# Altium schematic sheet Sensorunit.SchDoc
size 508 x 381 mm; SheetNumber: 1; SheetTotal: 1
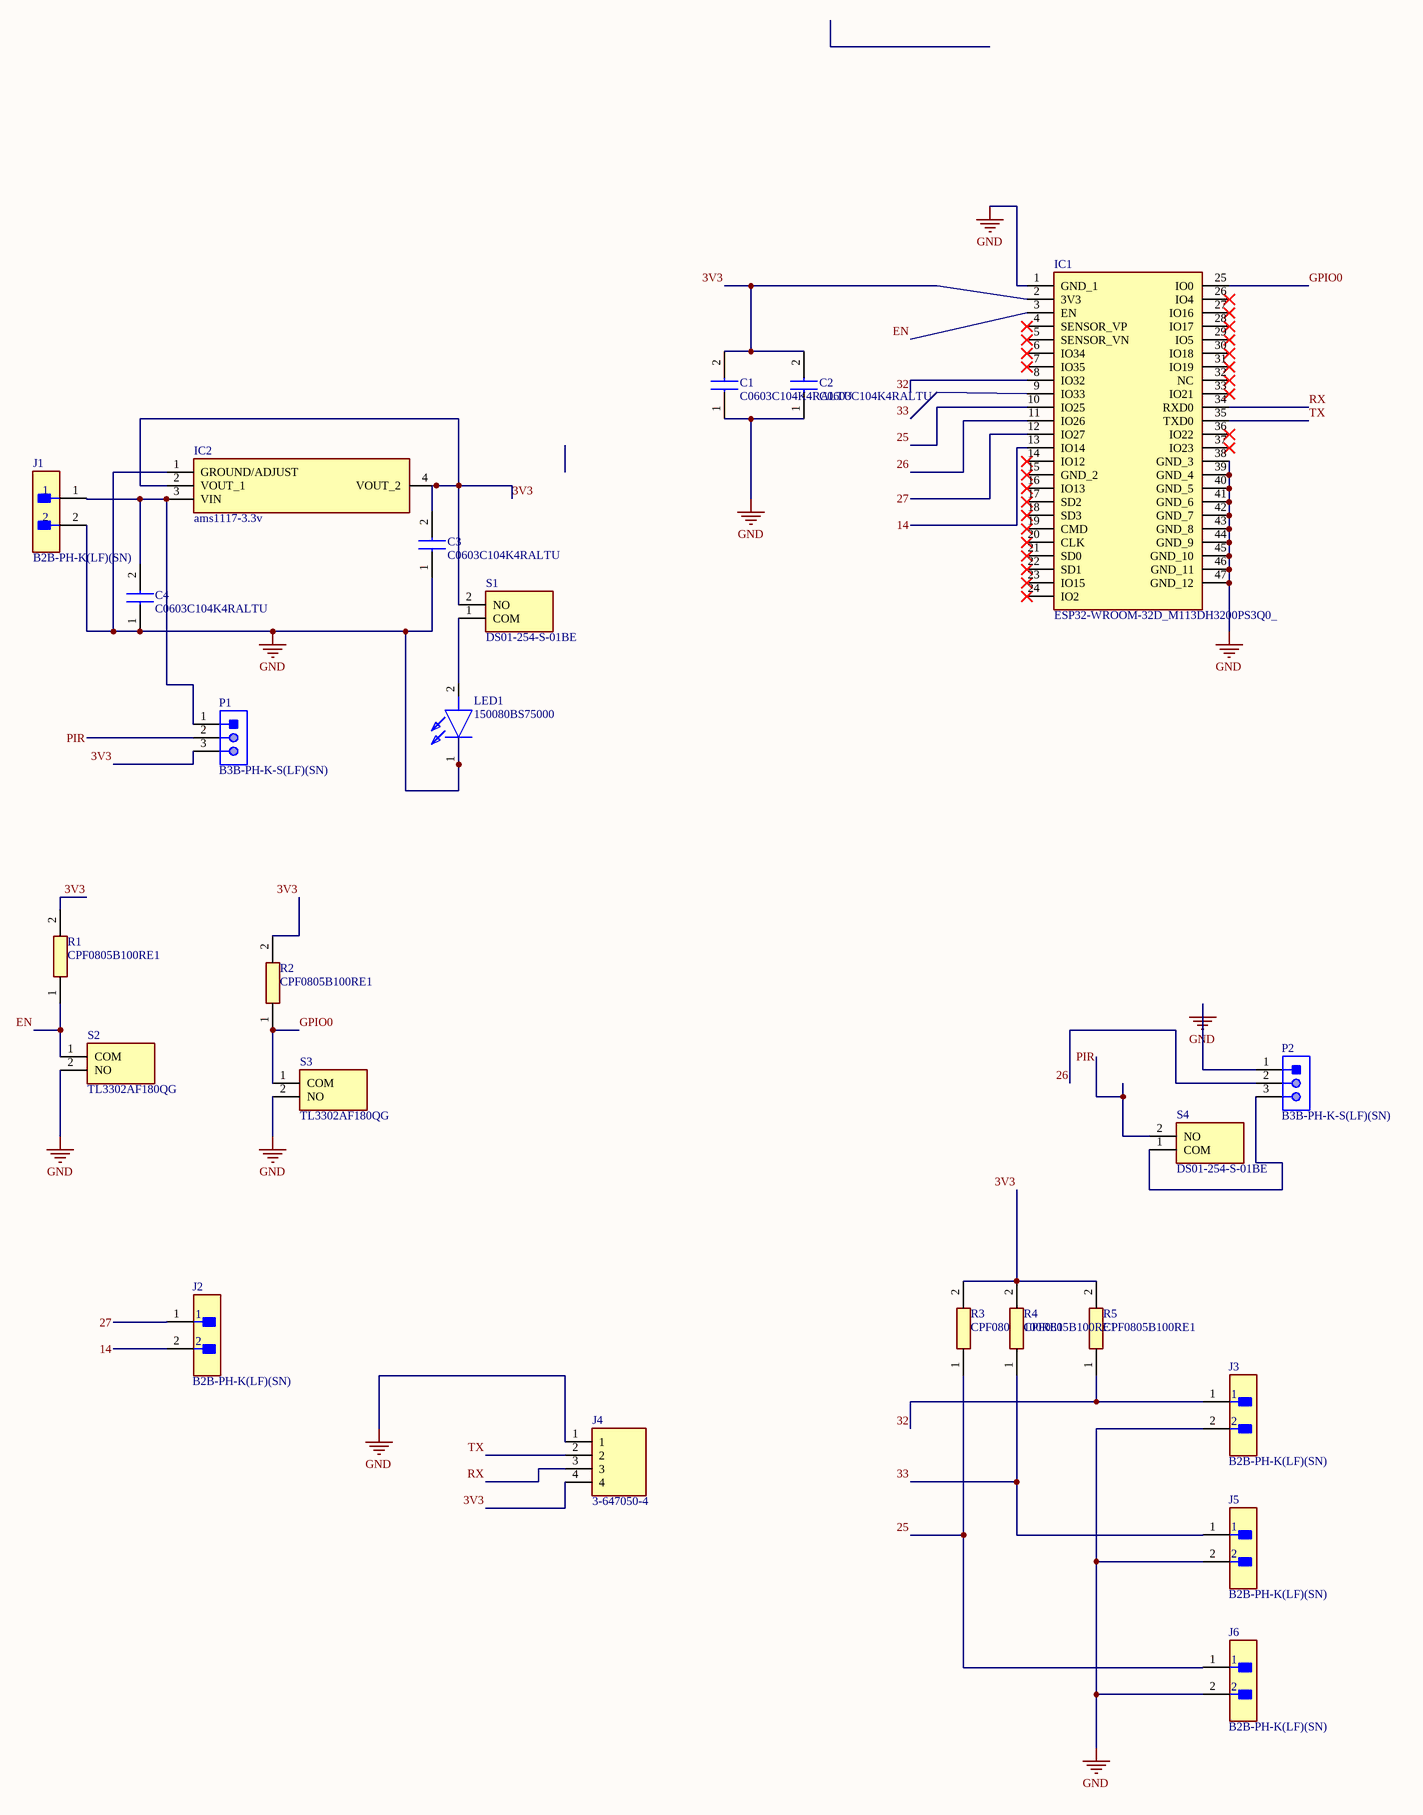
[diagram p0: Sensorunit.SchDoc]

## Parts
C1  C0603C104K4RALTU  [C0603]
C2  C0603C104K4RALTU  [C0603]
C3  C0603C104K4RALTU  [C0603]
C4  C0603C104K4RALTU  [C0603]
IC1  ESP32-WROOM-32D_M113DH3200PS3Q0_  [ESP32WROOM32DM113DH3200PS3Q0]
IC2  ams1117-3.3v  [SOT229P700X180-4N]
J1  B2B-PH-K(LF)(SN)  [FP-B2B-PH-K_LF_SN-MFG]
J2  B2B-PH-K(LF)(SN)  [FP-B2B-PH-K_LF_SN-MFG]
J3  B2B-PH-K(LF)(SN)  [FP-B2B-PH-K_LF_SN-MFG]
J4  3-647050-4  [SHDR4W66P0X254_1X4_1016X635X1079P]
J5  B2B-PH-K(LF)(SN)  [FP-B2B-PH-K_LF_SN-MFG]
J6  B2B-PH-K(LF)(SN)  [FP-B2B-PH-K_LF_SN-MFG]
LED1  150080BS75000  [LEDC2012X80N]
P1  B3B-PH-K-S(LF)(SN)  [JST-B3B-PH-K-S-3_V]
P2  B3B-PH-K-S(LF)(SN)  [JST-B3B-PH-K-S-3_V]
R1  CPF0805B100RE1  [RESC2012X65N]
R2  CPF0805B100RE1  [RESC2012X65N]
R3  CPF0805B100RE1  [RESC2012X65N]
R4  CPF0805B100RE1  [RESC2012X65N]
R5  CPF0805B100RE1  [RESC2012X65N]
S1  DS01-254-S-01BE  [DS01254S01BE]
S2  TL3302AF180QG  [TL3302AF180QG]
S3  TL3302AF180QG  [TL3302AF180QG]
S4  DS01-254-S-01BE  [DS01254S01BE]

## Nets
GND: C1.1 C2.1 C3.1 C4.1 IC1.1(GND_1) IC1.38(GND_3) IC1.39(GND_4) IC1.40(GND_5) IC1.41(GND_6) IC1.42(GND_7) IC1.43(GND_8) IC1.44(GND_9) IC1.45(GND_10) IC1.46(GND_11) IC1.47(GND_12) IC2.1(GROUND/ADJUST) J1.2 J3.2 J4.1 J5.2 J6.2 LED1.1(K) P2.1 S2.2(NO) S3.2(NO)
3V3: C1.2 C2.2 C3.2 IC1.2(3V3) IC2.2(VOUT_1) IC2.4(VOUT_2) J4.4 P1.3 R1.2 R2.2 R3.2 R4.2 R5.2 S1.2(NO)
14: IC1.13(IO14) J2.2
25: IC1.10(IO25) J6.1 R3.1
26: IC1.11(IO26) P2.2
27: IC1.12(IO27) J2.1
32: IC1.8(IO32) J3.1 R5.1
33: IC1.9(IO33) J5.1 R4.1
EN: IC1.3(EN) R1.1 S2.1(COM)
GPIO0: IC1.25(IO0) R2.1 S3.1(COM)
PIR: P1.2 S4.2(NO)
RX: IC1.34(RXD0) J4.3
TX: IC1.35(TXD0) J4.2
NetC4_2: C4.2 IC2.3(VIN) J1.1 P1.1
NetLED1_2: LED1.2(A) S1.1(COM)
NetP2_3: P2.3 S4.1(COM)

Not connected (* = marked no-connect by the designer): IC1 4(SENSOR_VP)* 5(SENSOR_VN)* 6(IO34)* 7(IO35)* 14(IO12)* 15(GND_2)* 16(IO13)* 17(SD2)* 18(SD3)* 19(CMD)* 20(CLK)* 21(SD0)* 22(SD1)* 23(IO15)* 24(IO2)* 26(IO4)* 27(IO16)* 28(IO17)* 29(IO5)* 30(IO18)* 31(IO19)* 32(NC)* 33(IO21)* 36(IO22)* 37(IO23)*

## Library data of the parts
C1-C4 = C0603C104K4RALTU: Capacitor; Manufacturer_Name: KEMET; Datasheet Link: https://content.kemet.com/datasheets/KEM_C1018_X7R_SnPb_SMD.pdf; Height: 0.87mm; Manufacturer_Part_Number: C0603C104K4RALTU; Mouser Part Number: 80-C0603C104K4RAL; Mouser Price/Stock: https://www.mouser.co.uk/ProductDetail/KEMET/C0603C104K4RALTU?qs=Av9gTi0A7zOg0Qy3fuNTKg%3D%3D; Arrow Part Number: C0603C104K4RALTU; Arrow Price/Stock: https://www.arrow.com/en/products/c0603c104k4raltu/kemet-corporation
IC1 = ESP32-WROOM-32D_M113DH3200PS3Q0_: Integrated Circuit; Manufacturer_Name: Espressif Systems; Manufacturer_Part_Number: ESP32-WROOM-32D(M113DH3200PS3Q0); Datasheet Link: https://componentsearchengine.com/Datasheets/1/ESP32-WROOM-32D(M113DH3200PS3Q0).pdf; Height: 3.2mm; Mouser Part Number: 356-ESPWROOM3200PS3; Mouser Price/Stock: https://www.mouser.co.uk/ProductDetail/Espressif-Systems/ESP32-WROOM-32DM113DH3200PS3Q0?qs=wnTfsH77Xs7iNQbBNob0RQ%3D%3D
IC2 = ams1117-3.3v: Integrated Circuit; Manufacturer_Name: Advanced Monolithic Systems; Datasheet Link: http://www.advanced-monolithic.com/pdf/ds1117.pdf; Height: 1.8mm; Manufacturer_Part_Number: ams1117-3.3v
J1-J3 J5 J6 = CMP-17439-000674-1: Connector Header Through Hole 2 position 0.079" (2.00mm); Gender: Male; Pitch: 2mm; Voltage Rating: 100V; Current Rating: 2A; Number of Positions: 2; Insulation Resistance: 1GR; Contact Plating: Tin; Color: Beige; Min Operating Temperature: -25°C; Mount: Through Hole; Number of Rows: 1; Termination: Crimp; Max Operating Temperature: 85°C; Lead Free: Lead Free; Contact Material: Brass; Material: Polyamide
J4 = 3-647050-4: Connector; Manufacturer_Name: TE Connectivity; Datasheet Link: https://www.te.com/commerce/DocumentDelivery/DDEController?Action=showdoc&DocId=Customer+Drawing%7F647050%7FU%7Fpdf%7FEnglish%7FENG_CD_647050_U.pdf%7F3-647050-4; Height: 10.79mm; Manufacturer_Part_Number: 3-647050-4; Mouser Part Number: 571-3-647050-4; Mouser Price/Stock: https://www.mouser.co.uk/ProductDetail/TE-Connectivity-AMP/3-647050-4?qs=W5ux9j661SoBsMK9vpa9%252BQ%3D%3D; Arrow Part Number: 3-647050-4; Arrow Price/Stock: https://www.arrow.com/en/products/3-647050-4/te-connectivity?region=nac
LED1 = 150080BS75000: LED; Manufacturer_Name: Wurth Elektronik; Datasheet Link: https://katalog.we-online.com/led/datasheet/150080BS75000.pdf; Height: 0.8mm; Manufacturer_Part_Number: 150080BS75000; Mouser Part Number: 710-150080BS75000; Mouser Price/Stock: https://www.mouser.co.uk/ProductDetail/Wurth-Elektronik/150080BS75000?qs=2kOmHSv6VfT2tBo3UPVqAQ%3D%3D
P1 P2 = CMP-2000-05164-1: Male Header, Pitch 2 mm, 1 x 3 Position, Height 6 mm, Tail Length 3.4 mm, -25 to 85 degC, RoHS, Bulk; Manufacturer: JST; Style/Orientation: StraightHeader/Plug; Pitch: 2mm; No of Positions: 3; Termination: Crimp; Manufacturer URL: http://www.jst.com/home2.html; Datasheet Version: Oct-06; Type: ShroudedHeader; Datasheet URL: https://datasheet.ciiva.com/11746/0900766b80826550-11746939.pdf
R1-R5 = CPF0805B100RE1: Resistor; Manufacturer_Name: TE Connectivity; Datasheet Link: http://docs-europe.electrocomponents.com/webdocs/13d1/0900766b813d116f.pdf; Height: 0.65mm; Manufacturer_Part_Number: CPF0805B100RE1; Mouser Part Number: 279-CPF0805B100RE1; Mouser Price/Stock: https://www.mouser.co.uk/ProductDetail/TE-Connectivity-Holsworthy/CPF0805B100RE1?qs=9ylKvqdyudkCWLPT1QvLZQ%3D%3D; Arrow Part Number: CPF0805B100RE1; Arrow Price/Stock: https://www.arrow.com/en/products/cpf0805b100re1/te-connectivity?region=nac
S1 S4 = DS01-254-S-01BE: Switch; Manufacturer_Name: CUI Devices; Datasheet Link: https://www.mouser.in/datasheet/2/670/ds01_254-1777712.pdf; Height: 7mm; Manufacturer_Part_Number: DS01-254-S-01BE; Mouser Part Number: 490-DS01-254-S-01BE; Mouser Price/Stock: https://www.mouser.co.uk/ProductDetail/CUI-Devices/DS01-254-S-01BE?qs=wnTfsH77Xs7pnks1JfJqEQ%3D%3D; Arrow Part Number: DS01-254-S-01BE; Arrow Price/Stock: https://www.arrow.com/en/products/ds01-254-s-01be/cui-devices?region=nac
S2 S3 = TL3302AF180QG: Switch; Manufacturer_Name: E-Switch; Datasheet Link: https://componentsearchengine.com/Datasheets/2/TL3302AF180QG.pdf; Height: 5mm; Manufacturer_Part_Number: TL3302AF180QG; Mouser Part Number: 612-TL3302A; Mouser Price/Stock: https://www.mouser.co.uk/ProductDetail/E-Switch/TL3302AF180QG?qs=HKd%2Fp3M7KlXmC8e3lU%2FDFQ%3D%3D